# EAGLE schematic automat (EAGLE 9.1.0)

## Library data of the parts

## Module AUTOMAT
Ports: QB(io) QC(io) QA(io)
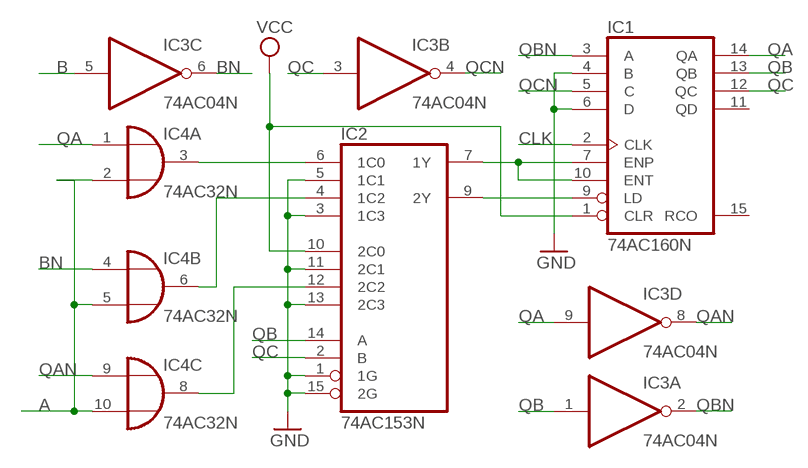
[diagram p0: schematic, module AUTOMAT, sheet 1]

### Parts
IC1  74AC160N  [DIL16]
IC2  74AC153N  [DIL16]
IC3  74AC04N  [DIL14]
IC4  74AC32N  [DIL14]

### Nets
A: IC4.2(A:I1) IC4.5(B:I1) IC4.10(C:I1)
B: IC3.5(C:I)
BN: IC3.6(C:O) IC4.4(B:I0)
CLK: IC1.2(CLK)
GND: IC1.4(B) IC1.6(D) IC2.1(1G) IC2.3(1C3) IC2.5(1C1) IC2.11(2C1) IC2.13(2C3) IC2.15(2G)
N$1: IC1.7(ENP) IC1.10(ENT) IC2.7(1Y)
N$2: IC2.4(1C2) IC4.6(B:O)
N$3: IC1.9(LD) IC2.9(2Y)
N$4: IC2.12(2C2) IC4.8(C:O)
N$8: IC2.6(1C0) IC4.3(A:O)
QA: IC1.14(QA) IC3.9(D:I) IC4.1(A:I0)
QAN: IC3.8(D:O) IC4.9(C:I0)
QB: IC1.13(QB) IC2.14(A) IC3.1(A:I)
QBN: IC1.3(A) IC3.2(A:O)
QC: IC1.12(QC) IC2.2(B) IC3.3(B:I)
QCN: IC1.5(C) IC3.4(B:O)
VCC: IC1.1(CLR) IC2.10(2C0)
Unconnected: IC1.11(QD) IC1.15(RCO) IC3.10(E:O) IC3.11(E:I) IC3.12(F:O) IC3.13(F:I) IC4.11(D:O) IC4.12(D:I0) IC4.13(D:I1)

### Power pins joined to a net without a drawn wire
GND: IC1.8(GND) IC2.8(GND) IC3.7(P:GND) IC4.7(P:GND)
VCC: IC1.16(VCC) IC2.16(VCC) IC3.14(P:VCC) IC4.14(P:VCC)

### Library data of the parts
IC1 = 74xx-eu:74*160: Synchronous 4-bit COUNTER
IC2 = 74xx-eu:74*153: Dual 4-line to 1-line data SELECTOR/MULTIPLEXER
IC3 = 74xx-eu:74*04: Hex INVERTER
IC4 = 74xx-eu:74*32: Quad 2-input OR gate